# EAGLE design DLPG ctrl v3 (EAGLE 7.7.0)
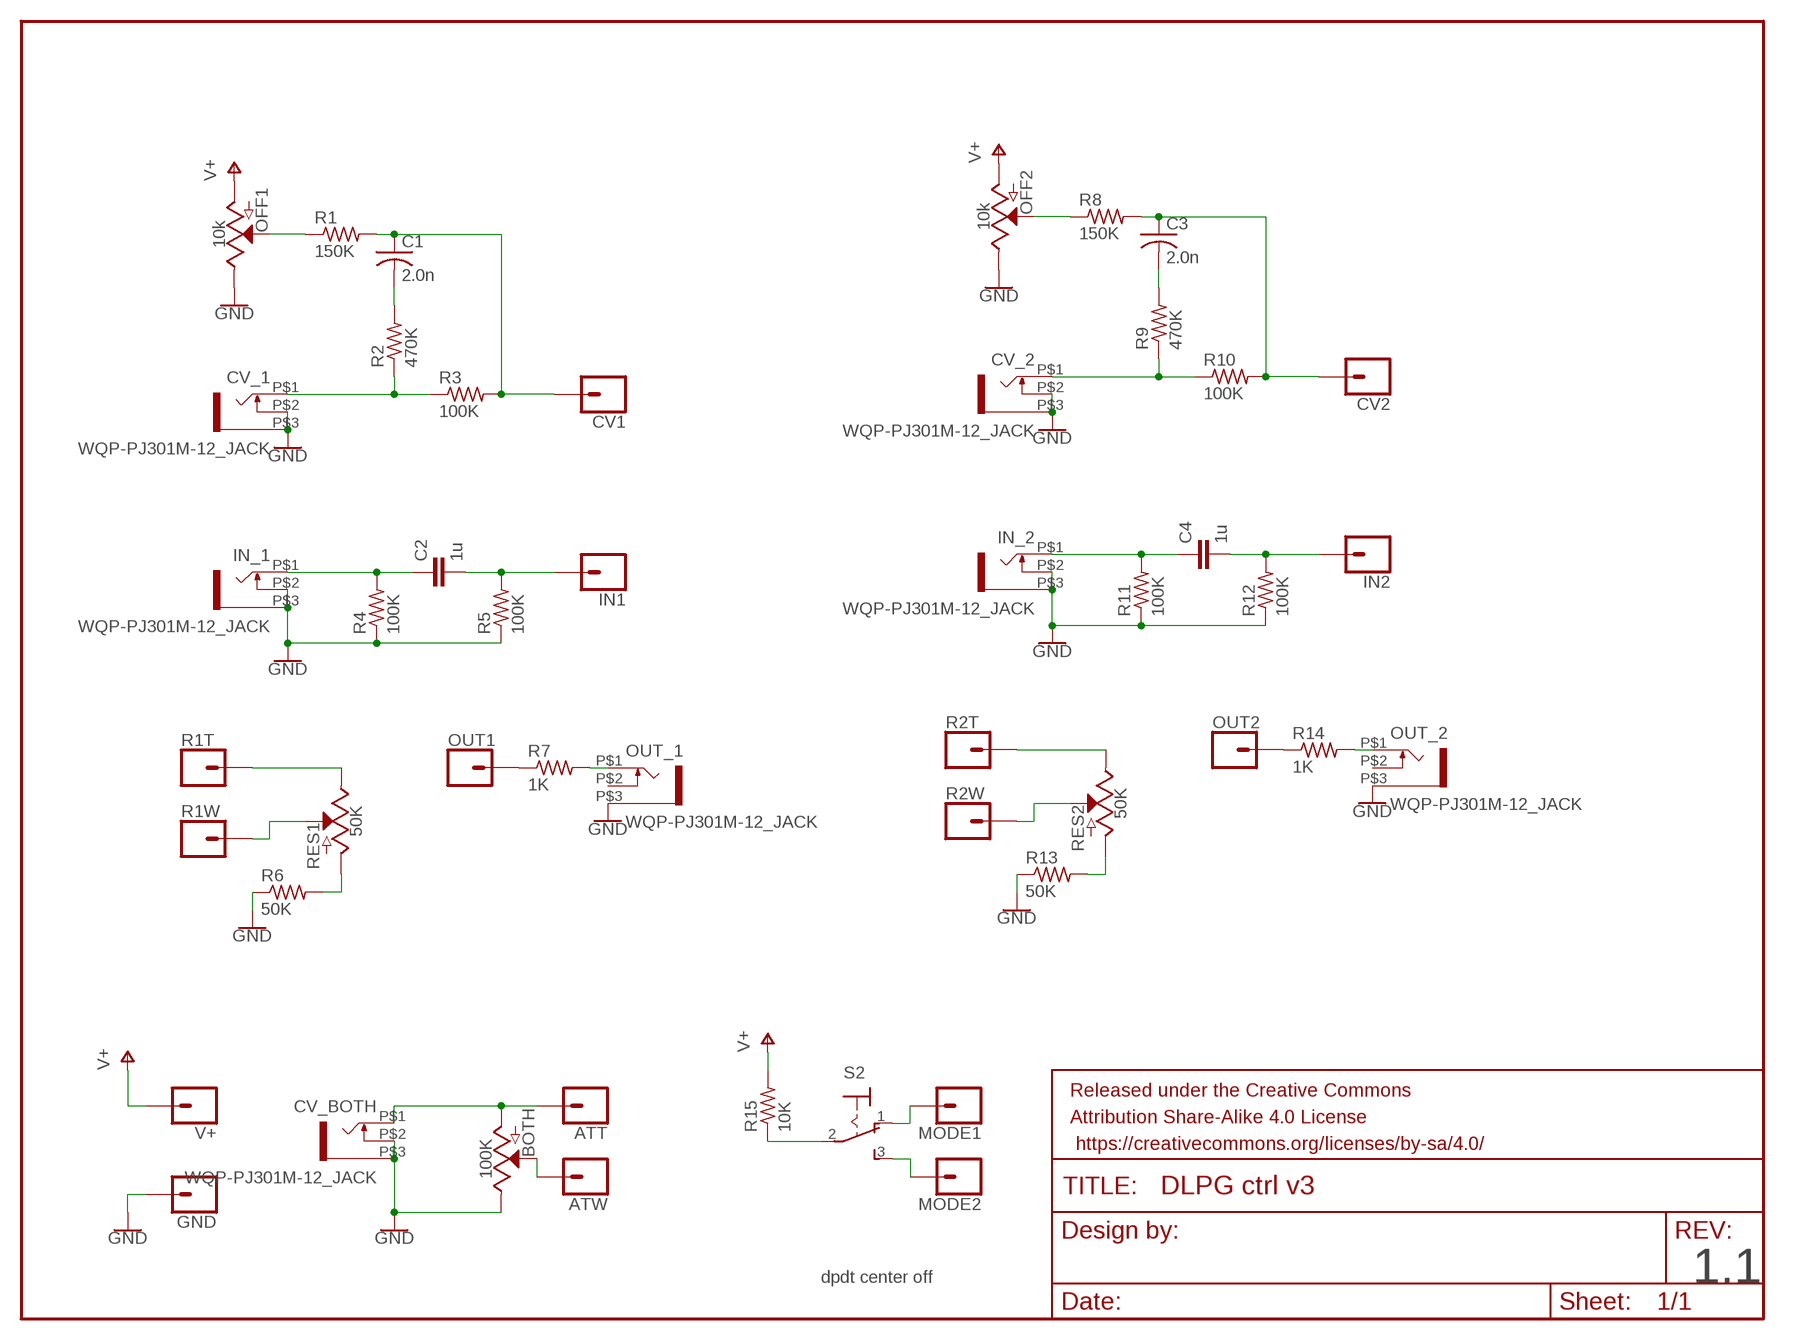
[diagram p0: schematic, sheet 1]

## Parts
ATT  CONN_01  [1X01]
ATW  CONN_01  [1X01]
BOTH  100K  POTENTIOMETER-PTH-9MM-1/20W-20%  [POT-PTH-ALPS]
C1  2.0n  C-USC0805K  [C0805K]
C2  1u  C-EUC2220K  [C2220K]
C3  2.0n  C-USC0805K  [C0805K]
C4  1u  C-EUC2220K  [C2220K]
CV1  CONN_01  [1X01]
CV2  CONN_01  [1X01]
CV_1  WQP-PJ301M-12_JACK  [WQP-PJ301M-12_JACK]
CV_2  WQP-PJ301M-12_JACK  [WQP-PJ301M-12_JACK]
CV_BOTH  WQP-PJ301M-12_JACK  [WQP-PJ301M-12_JACK]
FRAME1  FRAME-LETTERNO_PACKAGE  [DUMMY]
GND  CONN_01  [1X01]
IN1  CONN_01  [1X01]
IN2  CONN_01  [1X01]
IN_1  WQP-PJ301M-12_JACK  [WQP-PJ301M-12_JACK]
IN_2  WQP-PJ301M-12_JACK  [WQP-PJ301M-12_JACK]
MODE1  CONN_01  [1X01]
MODE2  CONN_01  [1X01]
OFF1  10k  POTENTIOMETER-PTH-9MM-1/20W-20%  [POT-PTH-ALPS]
OFF2  10k  POTENTIOMETER-PTH-9MM-1/20W-20%  [POT-PTH-ALPS]
OUT1  CONN_01  [1X01]
OUT2  CONN_01  [1X01]
OUT_1  WQP-PJ301M-12_JACK  [WQP-PJ301M-12_JACK]
OUT_2  WQP-PJ301M-12_JACK  [WQP-PJ301M-12_JACK]
R1  150K  R-US_M0805  [M0805]
R1T  CONN_01  [1X01]
R1W  CONN_01  [1X01]
R2  470K  R-US_M0805  [M0805]
R2T  CONN_01  [1X01]
R2W  CONN_01  [1X01]
R3  100K  R-US_M0805  [M0805]
R4  100K  R-US_M0805  [M0805]
R5  100K  R-US_M0805  [M0805]
R6  50K  R-US_M0805  [M0805]
R7  1K  R-US_M0805  [M0805]
R8  150K  R-US_M0805  [M0805]
R9  470K  R-US_M0805  [M0805]
R10  100K  R-US_M0805  [M0805]
R11  100K  R-US_M0805  [M0805]
R12  100K  R-US_M0805  [M0805]
R13  50K  R-US_M0805  [M0805]
R14  1K  R-US_M0805  [M0805]
R15  10K  R-US_M0805  [M0805]
RES1  50K  POTENTIOMETER-PTH-9MM-1/20W-20%  [POT-PTH-ALPS]
RES2  50K  POTENTIOMETER-PTH-9MM-1/20W-20%  [POT-PTH-ALPS]
S2  M9040P  [M9040P]
V+  CONN_01  [1X01]

## Nets
GND: BOTH.P$1(E) CV_1.P$2 CV_1.P$3 CV_2.P$2 CV_2.P$3 CV_BOTH.P$2 CV_BOTH.P$3 GND.1 IN_1.P$2 IN_1.P$3 IN_2.P$2 IN_2.P$3 OFF1.P$1(E) OFF2.P$1(E) OUT_1.P$3 OUT_2.P$3 R4.1 R5.1 R6.1 R11.1 R12.1 R13.1
N$1: OFF1.P$2(S) R1.1
N$2: C1.1 CV1.1 R1.2 R3.2
N$3: CV_1.P$1 R2.1 R3.1
N$4: C1.2 R2.2
N$5: C2.1 IN_1.P$1 R4.2
N$6: C2.2 IN1.1 R5.2
N$7: OFF2.P$2(S) R8.1
N$8: R1T.1 RES1.P$1(E)
N$9: R1W.1 RES1.P$2(S)
N$10: R6.2 RES1.P$3(A)
N$11: OUT_1.P$1 R7.2
N$12: OUT1.1 R7.1
N$13: C3.1 CV2.1 R8.2 R10.2
N$14: CV_2.P$1 R9.1 R10.1
N$15: C3.2 R9.2
N$16: C4.1 IN_2.P$1 R11.2
N$17: C4.2 IN2.1 R12.2
N$18: R2T.1 RES2.P$1(E)
N$19: R2W.1 RES2.P$2(S)
N$20: R13.2 RES2.P$3(A)
N$21: OUT_2.P$1 R14.2
N$22: OUT2.1 R14.1
N$23: R15.1 S2.2(P)
N$24: ATW.1 BOTH.P$2(S)
N$25: MODE2.1 S2.3(S)
N$26: MODE1.1 S2.1(O)
N$27: ATT.1 BOTH.P$3(A) CV_BOTH.P$1
V+: OFF1.P$3(A) OFF2.P$3(A) R15.2 V+.1
Unconnected: OUT_1.P$2 OUT_2.P$2

## Notes on the sheet
- dpdt center off | 1.1

## Library data of the parts
ATT ATW CV1 CV2 GND IN1 IN2 MODE1 MODE2 OUT1 OUT2 R1T R1W R2T R2W V+ = SparkFun-Connectors:CONN_01: Single connection point. Often used as Generic Header-pin footprint for 0.1 inch spaced/style header connections On any of the 0.1 inch spaced packages, you can populate with these: Break Away Headers - Straight <https://www.sparkfun.com/products/116> (PRT-00116) Break Away Male Headers - Right Angle <https://www.sparkfun.com/products/553> (PRT-00553) Female Headers <https://www.sparkfun.com/products/115> (PRT-00115) Break Away Headers - Machine Pin <https://www.sparkfun.com/products/117> (PRT-00117) Break Away Female Headers - Swiss Machine Pin <https://www.sparkfun.com/products/743> (PRT-00743) This device is also useful as a general connection point to wire up your design to another part of your project. Our various solder wires solder well into these plated through hole pads. Hook-Up Wire - Assortment (Stranded, 22 AWG) <https://www.sparkfun.com/products/11375> (PRT-11375) Hook-Up Wire - Assortment (Solid Core, 22 AWG) <https://www.sparkfun.com/products/11367> (PRT-11367) View the entire wire category on our website here <https://www.sparkfun.com/categories/141> Special notes: SMTSO-256-ET is a "flush mount" nut for a 4-40 screw. We mostly use this on specialty testbeds; it is a nice way to connect hardware to your PCB at an adjustable hieght. Also note, the SNAP packages are for using a snappable style connector. We sell a baggie of snaps and they are also used on two LilyPad designs: Snap Assortment - 30 pack (male and female) <https://www.sparkfun.com/products/11347> (DEV-11347) LilyPad Arduino SimpleSnap <https://www.sparkfun.com/products/10941> (DEV-10941) LilyPad SimpleSnap Protoboard <https://www.sparkfun.com/products/10940> (DEV-10940)
BOTH RES1 RES2 = SparkFun-Resistors:POTENTIOMETER: Potentiometer (Pot) Three-terminal potentiometers, with an adjustable wiper and two adjustable resistors. A pot can be used to create a configurable voltage divider, or as a variable resistor. Variants ALPS_POT and ALPS_POT_KIT - PTH, breadboard compatible, 9mm square pots Rotary Potentiometer - Linear (10k ohm) <https://www.sparkfun.com/products/9288> (COM-09288) The KIT variant exposes copper on only one side of the PTH pad, so the part can only be assembled on one side of the PCB. Useful for beginner soldering kits.; PROD_ID: RES-09177; SF_SKU: COM-09288; VALUE: 10k
C1 C3 = rcl:C-US: CAPACITOR, American symbol
C2 C4 = rcl:C-EU: CAPACITOR, European symbol
CV_1 CV_2 CV_BOTH IN_1 IN_2 OUT_1 OUT_2 = thonkiconn:WQP-PJ301M-12_JACK
FRAME1 = SparkFun-Aesthetics:FRAME-LETTER: Schematic Frame - Letter Standard 8.5x11 US Letter frame; DESIGNER: Nobody; VERSION: v01
OFF1 OFF2 = SparkFun-Resistors:POTENTIOMETER: Potentiometer (Pot) Three-terminal potentiometers, with an adjustable wiper and two adjustable resistors. A pot can be used to create a configurable voltage divider, or as a variable resistor. Variants ALPS_POT and ALPS_POT_KIT - PTH, breadboard compatible, 9mm square pots Rotary Potentiometer - Linear (10k ohm) <https://www.sparkfun.com/products/9288> (COM-09288) The KIT variant exposes copper on only one side of the PTH pad, so the part can only be assembled on one side of the PCB. Useful for beginner soldering kits.; PROD_ID: RES-09177; SF_SKU: COM-09288
R1-R15 = rcl:R-US_: RESISTOR, American symbol
S2 = switch:M9040P: TOGGLE SWITCH Marquardt

## Board
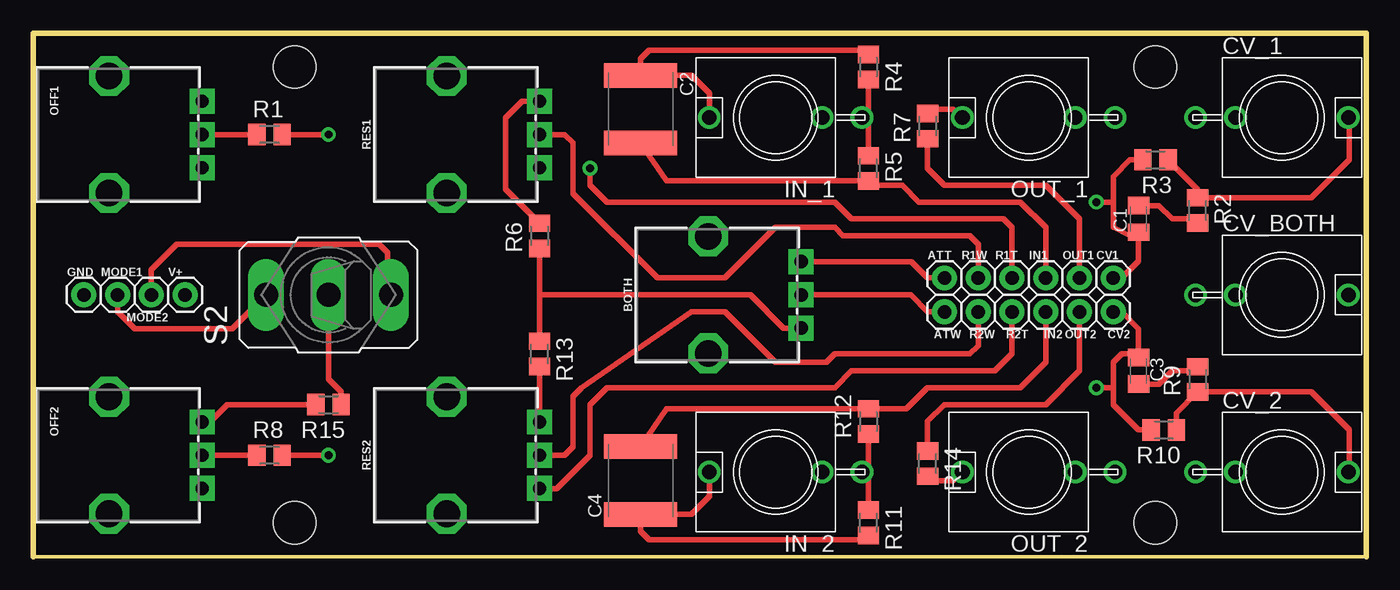
[diagram p1: board, top side]
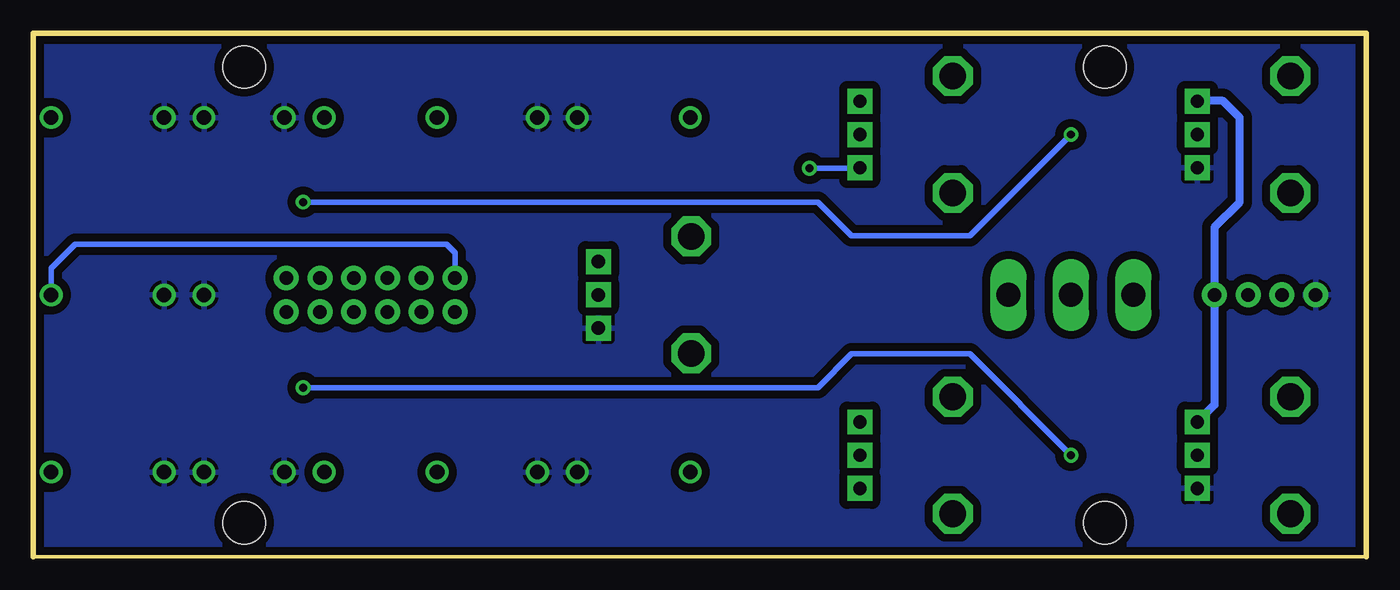
[diagram p2: board, bottom side, seen from below]

Size 100.33 x 39.37 mm. Coordinates in mm from the lower left corner, seen from the top.
Outline: 0,0 100.33,0 100.33,39.37 0,39.37 0,0
Copper layers (1*16): Top 0.035mm / dielectric 1.5mm / Bottom 0.035mm
Design rules "SparkFun": minimum track width 8mil, minimum drill 20mil, track to track 8mil, track to pad 8mil, pad to pad 8mil, via to via 8mil, smd to smd 8mil, copper to edge 10mil, drill to drill 8mil, minimum pad ring 12mil, minimum via ring 10mil, stop-mask expansion 4mil, vias tented up to drill 25mil, thermal gap 10mil
Holes 3.2 mm at 19.68,36.83 84.45,36.83 84.45,2.54 19.68,2.54

### Footprints (pad centres in the part's own frame; a part is rotated, then mirrored left to right if it is on the bottom)
1X01 = drill 1.016 pad 1.88: 1 0,0
POT-PTH-ALPS = drill 1 pad 1.88 square: P$1 7,-2.5; P$2 7,0; P$3 7,2.5 | drill 2 octagon: P$4 0,-4.4; P$5 0,4.4
C0805K = smd 1.3 x 1.6: 1 -1,0; 2 1,0
C2220K = smd 1.85 x 5.5: 1 -2.55,0; 2 2.55,0
WQP-PJ301M-12_JACK = drill 1.1: P$1 0,5; P$2 0,-3.5; P$3 0,-6.5
M0805 = smd 1.3 x 1.6: 1 -0.95,0; 2 0.95,0
M9040P = drill 1.803 long: 1 0,4.699; 2 0,0; 3 0,-4.699

### Placement (x,y rotation side)
ATT  68.58,20.95 0 top
ATW  68.58,18.41 180 top
BOTH  50.8,19.68 0 top
C1  83.19,25.4 90 top
C2  45.72,33.66 270 top
C3  83.19,13.97 270 top
C4  45.72,5.71 90 top
CV1  81.28,20.95 0 top
CV2  81.28,18.41 180 top
CV_1  93.98,33.02 270 top
CV_2  93.98,6.35 270 top
CV_BOTH  93.98,19.68 270 top
FRAME1  -49.53,72.39 0 top  (outside the outline)
GND  3.81,19.68 0 top
IN1  76.2,20.95 0 top
IN2  76.2,18.41 180 top
IN_1  55.88,33.02 90 top
IN_2  55.88,6.35 90 top
MODE1  6.35,19.68 0 top
MODE2  8.89,19.68 180 top
OFF1  5.71,31.75 0 top
OFF2  5.71,7.62 0 top
OUT1  78.74,20.95 0 top
OUT2  78.74,18.41 180 top
OUT_1  74.93,33.02 90 top
OUT_2  74.93,6.35 90 top
R1  17.78,31.75 0 top
R1T  73.66,20.95 0 top
R1W  71.12,20.95 0 top
R2  87.63,26.04 270 top
R2T  73.66,18.41 180 top
R2W  71.12,18.41 180 top
R3  84.45,29.84 180 top
R4  62.87,36.83 90 top
R5  62.87,29.21 270 top
R6  38.1,24.13 90 top
R7  67.31,32.38 90 top
R8  17.78,7.62 0 top
R9  87.63,13.34 90 top
R10  85.09,9.53 180 top
R11  62.87,2.54 270 top
R12  62.87,10.16 90 top
R13  38.1,15.24 270 top
R14  67.31,6.99 270 top
R15  22.23,11.43 180 top
RES1  31.11,31.75 0 top
RES2  31.11,7.62 0 top
S2  22.23,19.68 90 top
V+  11.43,19.68 0 top

### Tracks (layer width: path | path; a pad name or v marks a point on that pad's centre or on a via)
GND
  Top 0.406: R12.1 62.87,6.83 IN_2.P$3 | 62.23,6.2 IN_2.P$3 | R5.1 62.87,32.53 IN_1.P$3 62.87,33.51 R4.1 | R13.1 38.1,19.68 | 38.1,19.68 R6.1 | R11.1 62.87,5.87 IN_2.P$3 | BOTH.P$1 56.48,17.18 53.98,19.68 38.1,19.68
  pour Bottom (isolate 0.61): 0,0 0,39.37 100.33,39.37 100.33,0
N$1
  Top 0.406: OFF1.P$2 R1.1
N$2  (via drill 0.6)
  Top 0.406: CV1.1 81.92,20.95 83.19,22.23 C1.1 82.92,24.13 82.55,24.13 81.28,24.77 81.28,26.67 | R3.2 82.55,29.84 81.28,28.57 81.28,26.67 | R1.2 v22.23,31.75 | v80.01,26.67 81.28,26.67
  Bottom 0.406: v22.23,31.75 29.84,24.13 38.73,24.13 41.27,26.67 v80.01,26.67
N$3
  Top 0.406: R3.1 87.63,27.62 R2.1 92.71,26.98 | 92.71,26.98 92.94,26.98 | 92.71,26.98 96.2,26.98 99.06,29.84 99.06,32.94 CV_1.P$1
N$4
  Top 0.406: C1.2 84.72,26.4 85.72,25.4 87.31,25.4 R2.2
N$5
  Top 0.406: R4.2 62.55,38.1 46.35,38.1 45.72,37.47 C2.1 49.53,36.2 50.88,34.84 IN_1.P$1
N$6
  Top 0.406: IN1.1 76.2,24.77 74.3,26.67 66.67,26.67 65.41,27.94 63.19,27.94 R5.2 47.67,28.26 C2.2
N$7
  Top 0.406: OFF2.P$2 R8.1
N$8  (via drill 0.6)
  Top 0.406: R1T.1 73.66,24.77 73.03,25.4 61.59,25.4 60.33,26.67 43.18,26.67 41.91,27.94 v41.91,29.21
  Bottom 0.406: v41.91,29.21 38.16,29.21 RES1.P$1
N$9
  Top 0.406: R1W.1 71.12,23.5 70.48,24.13 60.96,24.13 60.33,24.77 55.88,24.77 52.07,20.95 46.99,20.95 40.64,27.3 40.64,31.11 40.01,31.75 RES1.P$2
N$10
  Top 0.406: RES1.P$3 36.79,34.25 35.56,33.02 35.56,27.62 R6.2
N$11
  Top 0.406: OUT_1.P$1 69.85,33.02 69.22,33.66 67.63,33.66 R7.2
N$12
  Top 0.406: R7.1 67.31,29.21 68.58,27.94 76.2,27.94 78.74,25.4 OUT1.1
N$13  (via drill 0.6)
  Top 0.406: CV2.1 81.92,18.41 83.19,17.14 C3.1 82.92,15.24 81.92,15.24 81.28,14.61 81.28,12.7 | R10.2 83.19,9.53 81.28,11.43 81.28,12.7 | R8.2 v22.23,7.62 | v80.01,12.7 81.28,12.7
  Bottom 0.406: v22.23,7.62 29.84,15.24 38.73,15.24 41.27,12.7 v80.01,12.7
N$14
  Top 0.406: R10.1 86.04,10.79 R9.1 96.2,12.38 99.06,9.53 99.06,6.43 CV_2.P$1
N$15
  Top 0.406: C3.2 84.72,12.97 85.72,13.97 87.31,13.97 R9.2
N$16
  Top 0.406: R11.2 62.55,1.27 46.35,1.27 45.72,1.91 C4.1 49.53,3.17 50.88,4.53 IN_2.P$1
N$17
  Top 0.406: IN2.1 76.2,14.61 74.3,12.7 67.31,12.7 65.72,11.11 R12.2 47.67,11.11 C4.2
N$18
  Top 0.406: R2T.1 73.66,15.24 72.39,13.97 61.59,13.97 60.33,12.7 43.18,12.7 41.91,11.43 41.91,7.62 39.37,5.08 38.16,5.08 RES2.P$1
N$19
  Top 0.406: 39.37,7.62 RES2.P$2 40.01,7.62 40.64,8.26 40.64,12.06 41.27,12.7 49.53,18.41 52.07,18.41 55.88,14.61 59.69,14.61 60.33,15.24 70.48,15.24 71.12,15.88 R2W.1
N$20
  Top 0.406: RES2.P$3 38.12,14.28 R13.2
N$21
  Top 0.406: OUT_2.P$1 69.85,6.35 69.22,5.71 67.63,5.71 R14.2
N$22
  Top 0.406: R14.1 67.31,10.16 68.58,11.43 76.2,11.43 78.74,13.97 OUT2.1
N$23
  Top 0.406: R15.1 23.18,12.38 22.23,13.34 S2.2
N$24
  Top 0.406: BOTH.P$2 66.04,19.68 67.31,18.41 ATW.1
N$25
  Top 0.406: MODE2.1 8.89,21.59 10.79,23.5 26.04,23.5 26.67,22.86 26.67,19.94 S2.3
N$26
  Top 0.406: MODE1.1 6.35,18.41 7.62,17.14 14.99,17.14 S2.1
N$27
  Top 0.406: BOTH.P$3 66.08,22.18 67.31,20.95 ATT.1
  Bottom 0.406: CV_BOTH.P$1 98.98,21.67 97.16,23.5 69.22,23.5 68.58,22.86 ATT.1
V+
  Top 0.406: OFF2.P$3 13.29,10.12 14.61,11.43 R15.2
  Bottom 0.61: OFF1.P$3 12.68,34.29 10.79,34.29 9.53,33.02 9.53,26.67 11.43,24.77 V+.1 11.43,11.4 OFF2.P$3